# Altium schematic sheet sheet3_nRF52832.SchDoc: Proximo: nRF52832
size A4; Organization: Ideetron B.V.; Address1: Dorpstraat 81; Address2: 3941 JL Doorn; Address3: 3941 JL Doorn; Address4: The Netherlands; SheetNumber: 3
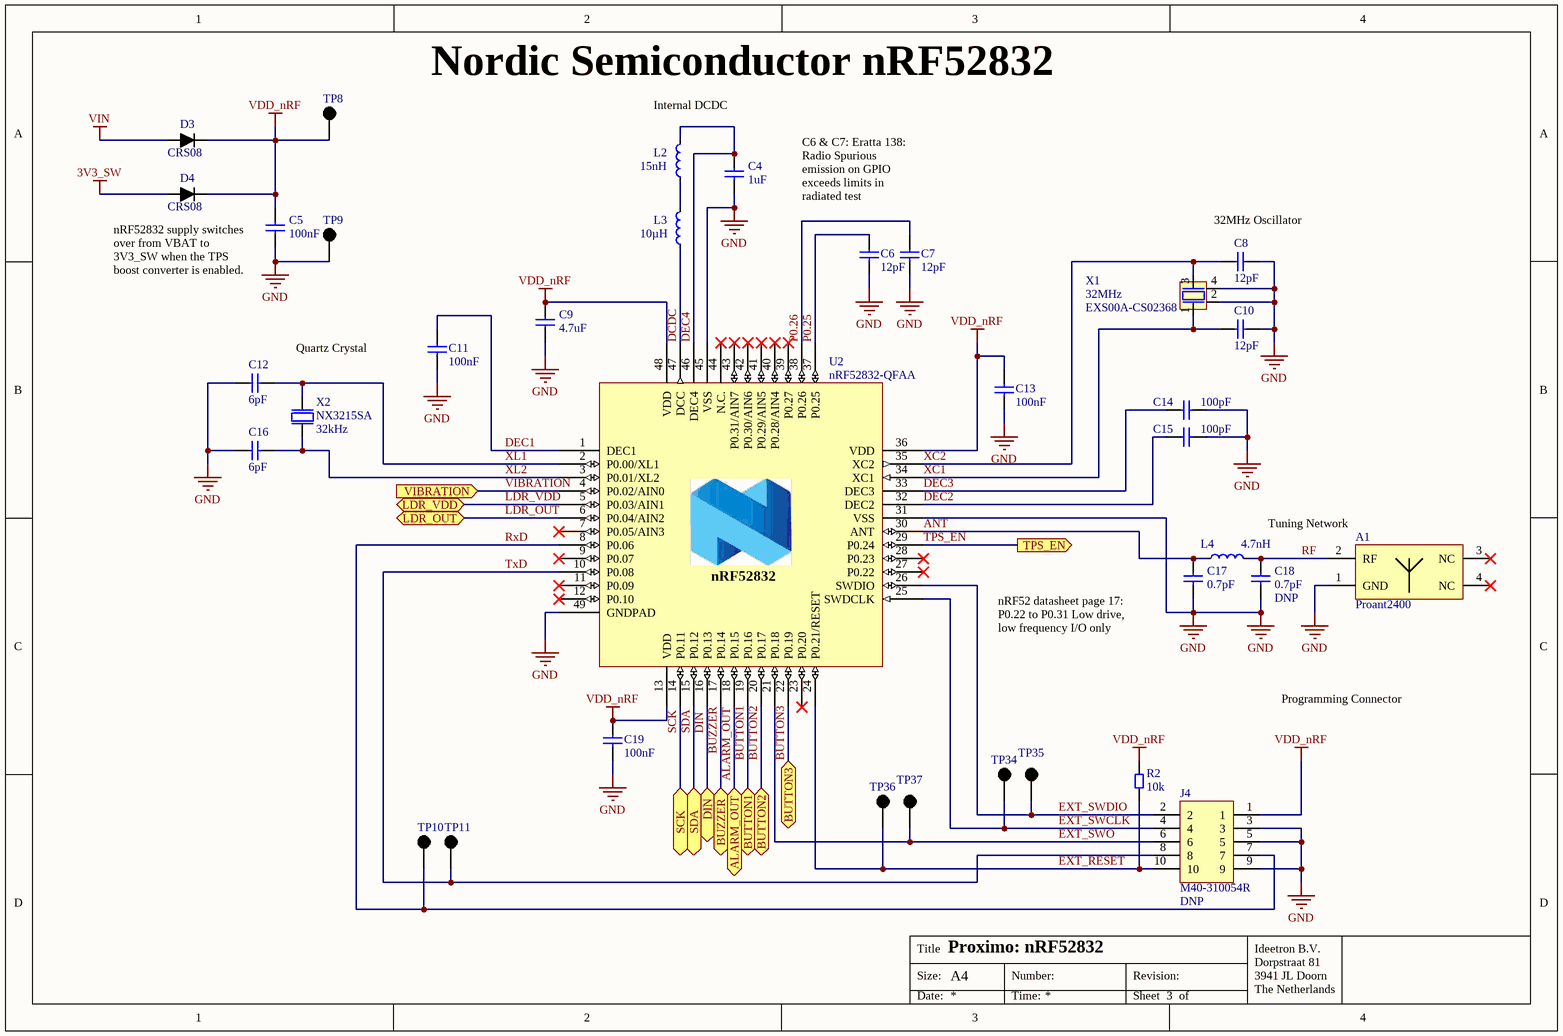
[diagram p0: sheet3_nRF52832.SchDoc]

## Parts
A1  Proant2400  [Proant2400]
C4  1uF  [CAP0603_GR18_MURATA]
C5  100nF  [CAP0603_GCx18_MURATA]
C6  12pF  [CAP0402_GCx15_Murata]
C7  12pF  [CAP0402_GCx15_Murata]
C8  12pF  [CAP0402_GCx15_Murata]
C9  4.7uF  [CAP0603_GR18_MURATA]
C10  12pF  [CAP0402_GCx15_Murata]
C11  100nF  [CAP0603_GCx18_MURATA]
C12  6pF  [CAP0603_GCx18_MURATA]
C13  100nF  [CAP0603_GCx18_MURATA]
C14  100pF  [CAP0603_GCx18_MURATA]
C15  100pF  [CAP0603_GCx18_MURATA]
C16  6pF  [CAP0603_GCx18_MURATA]
C17  0.7pF  [CAP0402 Johansen Technology]
C18  0.7pF  Remark: DNP  [CAP0402 Johansen Technology]
C19  100nF  [CAP0603_GCx18_MURATA]
D3  CRS08  [SOD-123F]
D4  CRS08  [SOD-123F]
J4  M40-310054R  Remark: DNP  [Harwin connector]
L2  15nH  [WE-MK_0402A]
L3  10µH  [74479777xxx_0805]
L4  4.7nH  [IND RF 0402HP-4N7XJLU]
R2  10k  [RES0603VISHAY]
TP8  testpad  [TestPad]  (value not drawn)  (no BOM)
TP9  testpad  [TestPad]  (value not drawn)  (no BOM)
TP10  testpad  [TestPad]  (value not drawn)  (no BOM)
TP11  testpad  [TestPad]  (value not drawn)  (no BOM)
TP34  testpad  [TestPad]  (value not drawn)  (no BOM)
TP35  testpad  [TestPad]  (value not drawn)  (no BOM)
TP36  testpad  [TestPad]  (value not drawn)  (no BOM)
TP37  testpad  [TestPad]  (value not drawn)  (no BOM)
U2  nRF52832-QFAA  [QFN40P600X600X90-48N]
X1  EXS00A-CS02368  Frequency: 32MHz  [NDK-32MHz-XTAL]
X2  NX3215SA  Frequency: 32kHz  [XTAL_3215]

## Ports
ALARM_OUT (bidir), BUTTON1 (bidir), BUTTON2 (bidir), BUTTON3 (bidir), BUZZER (bidir), DIN (bidir), LDR_OUT (bidir), LDR_VDD (bidir), SCK (bidir), SDA (bidir), TPS_EN (out), VIBRATION (in)

## Nets
3V3_SW: D4.A
GND: A1.1(GND) C4.1 C5.1 C6.1 C7.1 C8.1 C9.1 C10.1 C11.1 C12.1 C13.1 C14.2 C15.2 C16.1 C17.1 C18.1 C19.1 J4.3 J4.5 J4.9 TP9.1 U2.31(VSS) U2.45(VSS) U2.49(GNDPAD) X1.2(GND) X1.4(GND)
VDD_nRF: C5.2 C9.2 C13.2 C19.2 D3.C D4.C J4.1 R2.2 TP8.1 U2.13(VDD) U2.36(VDD) U2.48(VDD)
VIN: D3.A
ALARM_OUT: U2.18(P0.15) ; port ALARM_OUT
ANT: C17.2 L4.1 U2.30(ANT)
BUTTON1: U2.19(P0.16) ; port BUTTON1
BUTTON2: U2.20(P0.17) ; port BUTTON2
BUTTON3: U2.22(P0.19) ; port BUTTON3
BUZZER: U2.17(P0.14) ; port BUZZER
DCDC: L3.1 U2.47(DCC)
DEC1: C11.2 U2.1(DEC1)
DEC2: C15.1 U2.32(DEC2)
DEC3: C14.1 U2.33(DEC3)
DEC4: C4.2 L2.2 U2.46(DEC4)
DIN: U2.16(P0.13) ; port DIN
EXT_RESET: J4.10 R2.1 TP36.1 U2.24(P0.21/RESET)
EXT_SWCLK: J4.4 TP34.1 U2.25(SWDCLK)
EXT_SWDIO: J4.2 TP35.1 U2.26(SWDIO)
EXT_SWO: J4.6 TP37.1 U2.21(P0.18)
LDR_OUT: U2.6(P0.04/AIN2) ; port LDR_OUT
LDR_VDD: U2.5(P0.03/AIN1) ; port LDR_VDD
P0.25: C6.2 U2.37(P0.25)
P0.26: C7.2 U2.38(P0.26)
RF: A1.2(RF) C18.2 L4.2
RxD: J4.7 TP10.1 U2.8(P0.06)
SCK: U2.14(P0.11) ; port SCK
SDA: U2.15(P0.12) ; port SDA
TPS_EN: U2.29(P0.24) ; port TPS_EN
TxD: J4.8 TP11.1 U2.10(P0.08)
VIBRATION: U2.4(P0.02/AIN0) ; port VIBRATION
XC1: C10.2 U2.34(XC1) X1.1(inp)
XC2: C8.2 U2.35(XC2) X1.3(out)
XL1: C12.2 U2.2(P0.00/XL1) X2.2(out)
XL2: C16.2 U2.3(P0.01/XL2) X2.1(inp)
NetL2_1: L2.1 L3.2

Not connected (* = marked no-connect by the designer): A1 3(NC)* 4(NC)*; U2 7(P0.05/AIN3)* 9(P0.07)* 11(P0.09)* 12(P0.10)* 23(P0.20)* 27(P0.22)* 28(P0.23)* 39(P0.27)* 40(P0.28/AIN4)* 41(P0.29/AIN5)* 42(P0.30/AIN6)* 43(P0.31/AIN7)* 44(N.C.)*

## Notes on the sheet
- Nordic Semiconductor nRF52832
- (near L2) Internal DCDC
- C6 & C7: Eratta 138: Radio Spurious emission on GPIO exceeds limits in radiated test
- 32MHz Oscillator
- nRF52832 supply switches over from VBAT to 3V3_SW when the TPS boost converter is enabled.
- Quartz Crystal
- Tuning Network
- nRF52 datasheet page 17:
  P0.22 to P0.31 Low drive, low frequency I/O only
- Programming Connector
- Title
- Size:
- A4
- Number:
- Revision:
- Date:
- Time:
- Sheet
- of
- (in symbol nRF52832_QFAA) nRF52832

## Library data of the parts
A1 = Proant2400: Onboard SMD 2400 MHz Antenna for BLE, WLAN/Wifi; Manufacturer: Proant; Manufacturer Part Number: PRO-OB-440; Sponsor: TOP-electronics; value: Proant2400; Supplier 1: Digi-Key; Supplier 2: Digi-Key; Supplier Part Number 1: 1532-1001-6-ND; Supplier Part Number 2: 1532-1001-2-ND
C4 = CAP_0603_1uF: Capacitor 1uF X5R 0603 Murata; Manufacturer Part Number: GRM188R61E105KA12D; Sponsor: Nijkerk Electronics; Manufacturer: Murata; Pin Count: 2; Value: 1uF
C5 C11 C13 C19 = CAP_0603_100nF: Capacitor 0603 100nF; Manufacturer: Murata; Manufacturer Part Number: GCJ188R71C104KA01D; Sponsor: Nijkerk Electronics; Pin Count: 2; Value: 100nF
C6-C8 C10 = CAP_0402_12pF: Capacitor NP0 0402; Manufacturer: Murata; Manufacturer Part Number: GCM1555C1H120JA16D; Sponsor: Nijkerk Electronics; Pin Count: 2; Value: 12pF
C9 = CAP_0603_4u7: Capacitor X5R 0603 Murata; Manufacturer Part Number: GRM188R60J475KE19D; Sponsor: Nijkerk Electronics; Manufacturer: Murata; Pin Count: 2; Value: 4.7uF
C12 C16 = CAP_0603_6pF: Capacitor NP0 0603 50V; Part Number: GCM1885C1H6R0CA16D; Manufacturer: Murata; Sponsor: Nijkerk Electronics; Manufacturer Part Number: GCM1885C1H6R0CA16D; Pin Count: 2; Value: 6pF
C14 C15 = CAP_0603_100pF: Capacitor 100pF 0603 NP0; Manufacturer: Murata; Manufacturer Part Number: GCM1885C1H101JA16D; Sponsor: Nijkerk Electronics; Pin Count: 2; Value: 100pF
C17 = CAP_0402_0p7F: Capacitor 0.7pF 0402; Manufacturer: Johansen Technology; Manufacturer Part Number: 500R07S0R7AV4T; Pin Count: 2; Value: 0.7pF; Sponsor: *; Remark: *; Supplier 1: Farnell; Supplier Part Number 1: 1885293
C18 = CAP_0402_0p7F: Capacitor 0.7pF 0402; Manufacturer Part Number: 500R07S0R7AV4T; Pin Count: 2; Value: 0.7pF; Sponsor: *; Supplier 1: Farnell; Supplier Part Number 1: 1885293
D3 D4 = CRS08 Schottky Diode: Manufacturer: Tohsiba; value: CRS08; Manufacturer Part Number: CRS08; Supplier 1: Mouser; Supplier Part Number 1: 757-CRS08(TE85R,Q,M)
J4 = Harwin Connector: Harwin connector 2Rows x 6 contacts M40-3100545R; value: M40-310054R; manufacturer: Harwin; Supplier 1: Mouser; Supplier Part Number 1: 855-M40-3100545R; Manufacturer Part Number: M40-310054R
L2 = WE-MK, 744784115A: WE-MK Multilayer Ceramic SMD Inductor, size 0402A, 15nH; Manufacturer: Wurth Elektronik; PublishedDate: Sep. 2016; Publisher: Wurth Elektronik; ComponentLink1Description: Manufacturer; ComponentLink1URL: http://www.we-online.de; ComponentLink2Description: Datasheet; ComponentLink2URL: http://katalog.we-online.de/pbs/datasheet/744784115A.pdf; PartNumber: 744784115A; Size: 0402A; Value: 15nH; Manufacturer Part Number: 744784115A
L3 = WE-PMI 0805, 74479777310A: WE-PMI Power Multilayer Inductor, L= 10.0µH; Manufacturer: Wurth Elektronik; partNo: 74479777310A; Inductance: 10.0µH; ComponentLink1Description: Manufacturer; ComponentLink1URL: http://www.we-online.de; Created by: Baojun Chen; Created Date: Dec.2015; ComponentLink2Description: Datasheet; ComponentLink2URL: http://katalog.we-online.de/pbs/datasheet/74479777310A.pdf; Sponsor: Wurth Elektronik; Value: 10µH; Manufacturer Part Number: 74479777310A
L4 = IND_0402 Coilcraft 500R07S0R7AV4T: High frequency chip inductor 0402 Coil Craft; Manufacturer: Coilcraft; Manufacturer Part Number: 500R07S0R7AV4T; Pin Count: 2; Value: 4.7nH; Supplier 1: Farnell; Supplier 2: Farnell; Supplier Part Number 1: 2285819RL; Supplier Part Number 2: 2285819; Remark: *; Sponsor: *
R2 = Resistor_10k: SMD Resistor 10k 0603; Manufacturer: Vishay; Manufacturer Part Number: CRCW060310K0FKTABC; Sponsor: MyProto - DVC; Value: 10k; Supplier 1: *; Supplier Part Number 1: *; Remark: *
TP8-TP11 TP34-TP37 = TestPad: Signal probe pad; value: testpad
U2 = nRF52832_QFAA: Multi-protocol Bluetooth Low Energy, ANT and 2.4GHz proprietary system-on-chip; Manufacturer: Nordic Semiconductor; Part Number: nRF52832-QFAA; Manufacturer Part Number: nRF52832-QFAA; Pin Count: 48; Value: nRF52832-QFAA; Supplier: Nordic Semiconductor; Supplier part number: nRF52832-QFAA; Footprint Doc: QFN-48; Remark: *; LatestRevisionDate: 2014-11-26; Publisher: Nordic Semiconductor; Published: 2014-11-26; Sponsor: Nordic Semiconductor
X1 = NDK_32MHZ_OCILLATOR: NDK  NX3225SA 32MHz Oscillator; Note: XTAL SMD 32.000MHz; Manufacturer: NDK; Manufacturer Part Number: NX3225SA; Pin Count: 4; Value: EXS00A-CS02368; Footprint Doc: XTAL_2016; Sponsor: NDK; Supplier 1: Digi-Key; Supplier Part Number 1: 644-1208-1-ND
X2 = NDK_32kHz: XTAL SMD 3215, 32.768kHz, Cl=9pF, Total Tol: ±50ppm; Part Number: XTAL_FC-135 32.768k; Manufacturer: NDK; Manufacturer Part Number: NX3215SA 32.768KHz EXS00A-MU00376; Note: XTAL SMD 32.768kHz, 3215; Pin Count: 2; Value: NX3215SA; Sponsor: NDK; Supplier 1: Digi-Key; Supplier Part Number 1: 644-1171-1-ND